# EAGLE design Antenna-V1 (EAGLE 9.3.2)
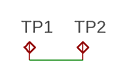
[diagram p0: schematic, sheet 1]

## Parts
TP1  TPTP20R  [TP20R]
TP2  TPTP20R  [TP20R]

## Nets
N$1: TP1.TP TP2.TP

## Library data of the parts
TP1 TP2 = testpad:TP: Test pad

## Board
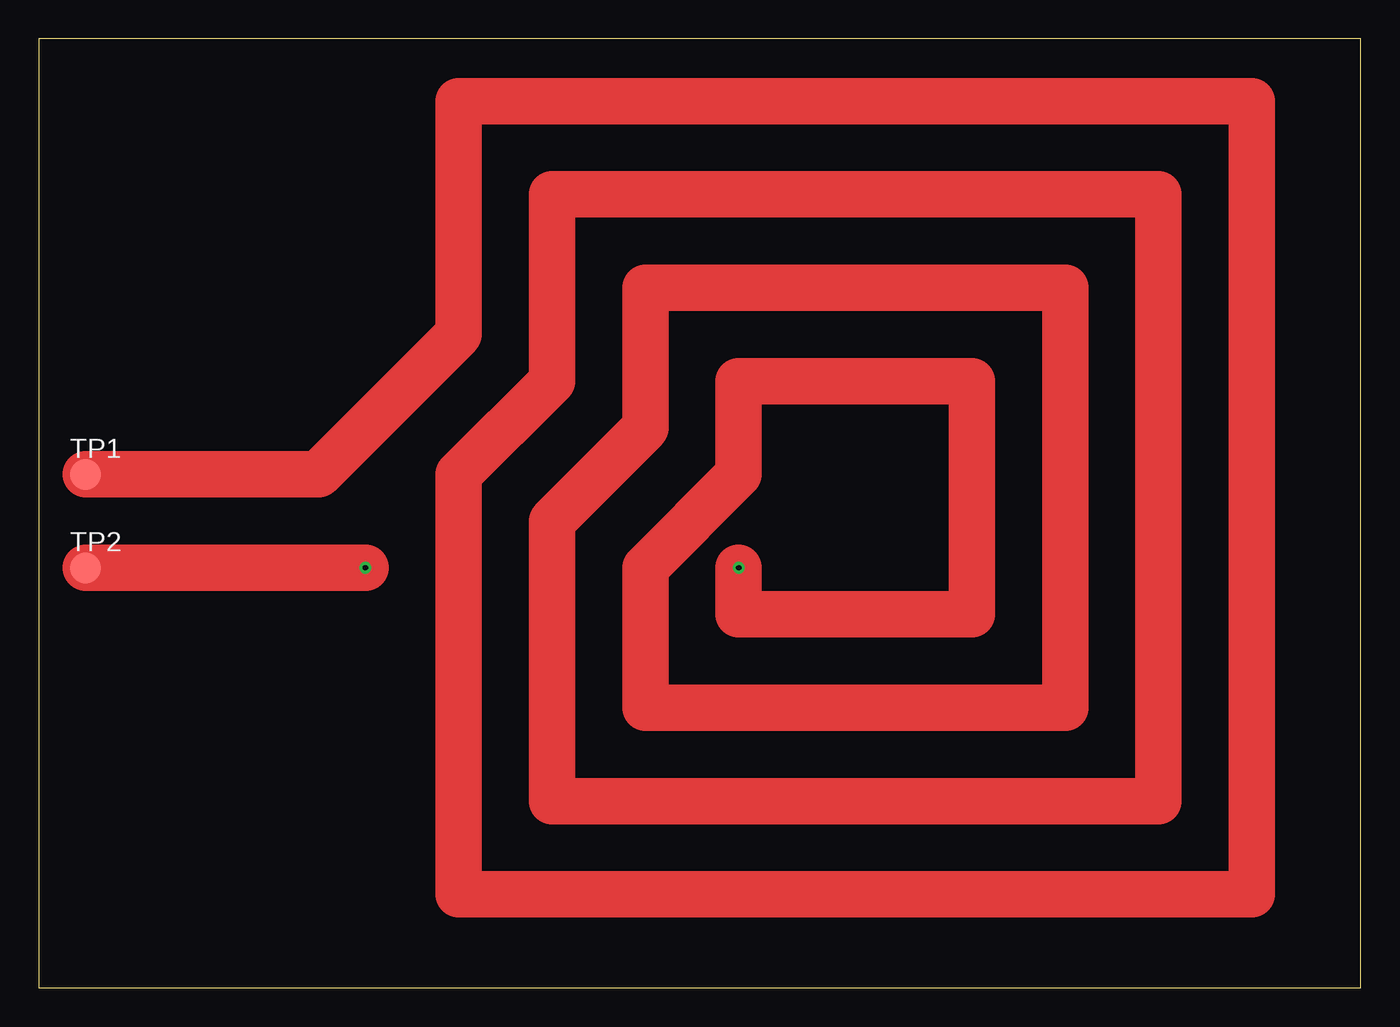
[diagram p1: board, top side]
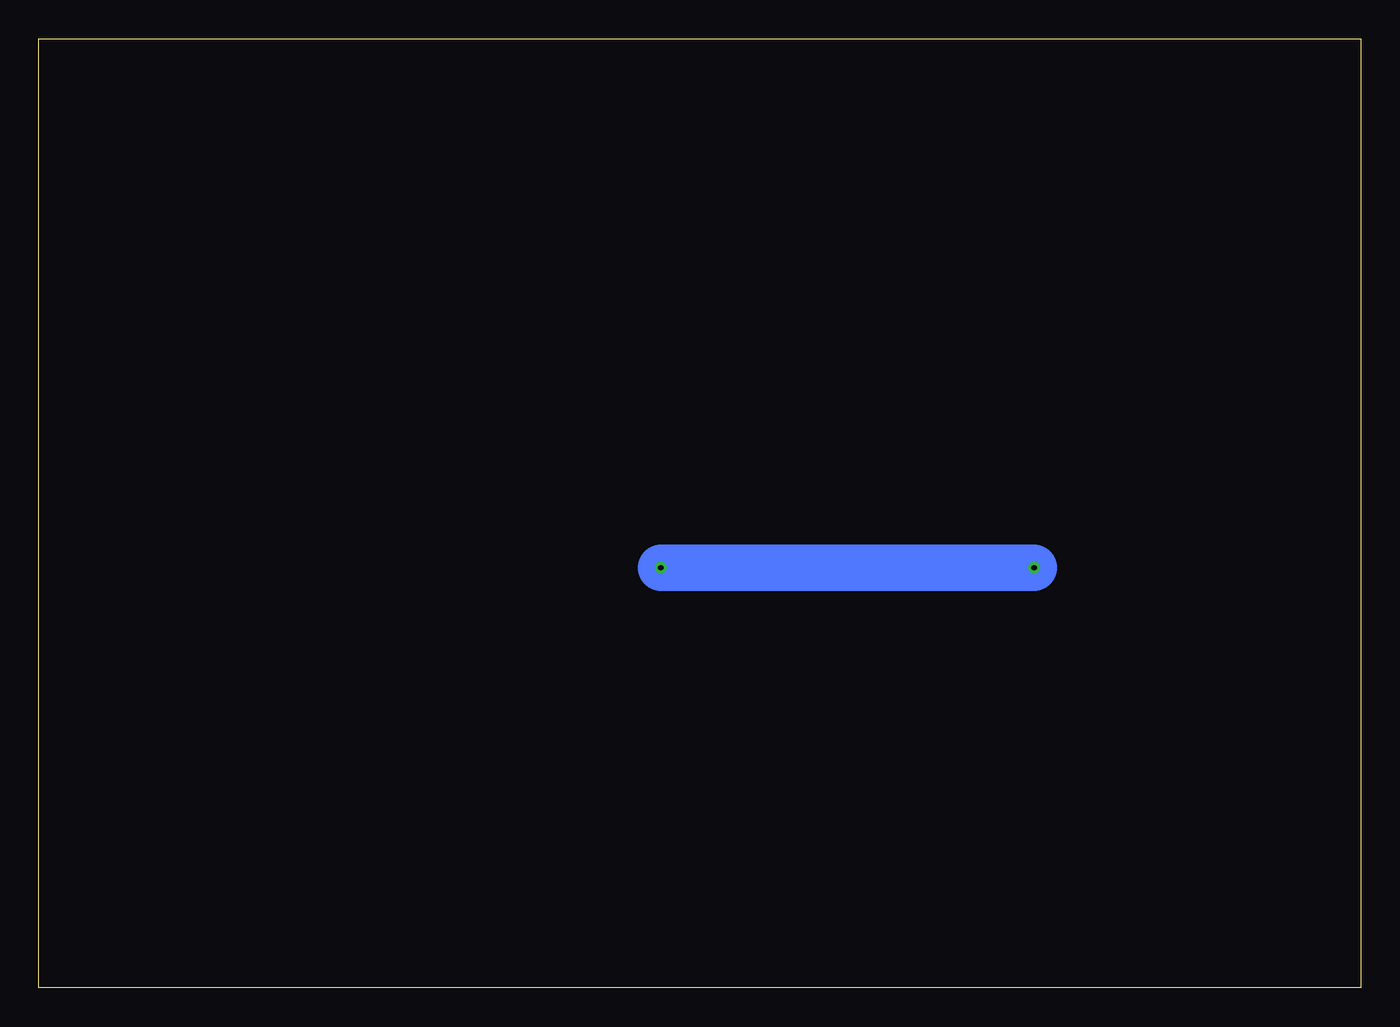
[diagram p2: board, bottom side, seen from below]

Size 85 x 61 mm. Coordinates in mm from the lower left corner, seen from the top.
Outline: 0,0 85,0 85,61 0,61 0,0
Copper layers (1*16): Top 0.035mm / dielectric 1.5mm / Bottom 0.035mm
Design rules "default": minimum track width 6mil, minimum drill 0.35mm, track to track 6mil, track to pad 6mil, pad to pad 6mil, via to via 6mil, smd to smd 6mil, copper to edge 40mil, drill to drill 6mil, minimum pad ring 10mil, minimum via ring 8mil, stop-mask expansion 4mil, vias tented up to drill 0mil, thermal gap 10mil

### Footprints (pad centres in the part's own frame; a part is rotated, then mirrored left to right if it is on the bottom)
TP20R = smd 2 x 2: TP 0,0

### Placement (x,y rotation side)
TP1  3,33 0 top
TP2  3,27 0 top

### Tracks (layer width: path | path; a pad name or v marks a point on that pad's centre or on a via)
N$1  (via drill 0.35)
  Top 3: TP1.TP 18,33 27,42 27,57 78,57 78,6 27,6 27,33 33,39 33,51 72,51 72,12 33,12 33,30 39,36 39,45 66,45 66,18 39,18 39,27 45,33 45,39 60,39 60,24 45,24 v45,27 | v21,27 TP2.TP
  Bottom 3: v45,27 v21,27